# Altium schematic sheet POWER SWITCH AND LDO.SchDoc
size 420 x 297 mm; SheetNumber: 3; SheetTotal: 5
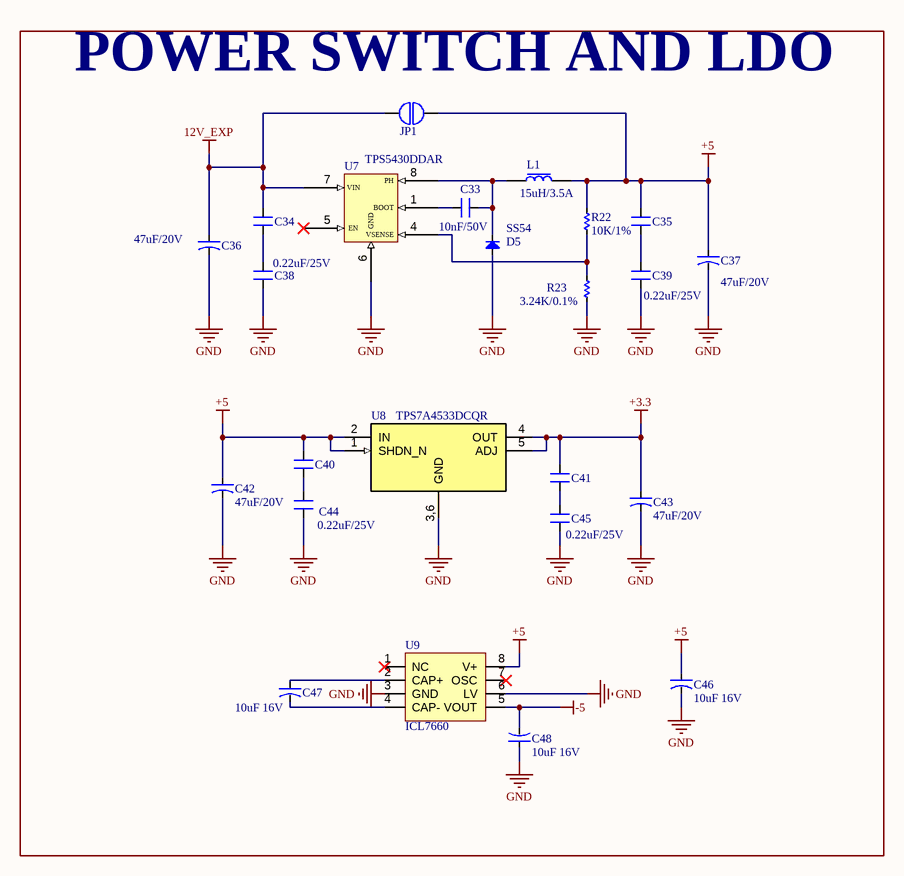
[diagram p0: POWER SWITCH AND LDO.SchDoc]

## Parts
C33  10nF/50V  [CN-SMD-0603]
C34  0.22uF/25V  [CN-SMD-0603]  (value not drawn)
C35  0.22uF/25V  [CN-SMD-0603]  (value not drawn)
C36  47uF/20V  [CAP TANT 2312]
C37  47uF/20V  [CAP TANT 2312]
C38  0.22uF/25V  [CN-SMD-0603]
C39  0.22uF/25V  [CN-SMD-0603]
C40  0.22uF/25V  [CN-SMD-0603]
C41  0.22uF/25V  [CN-SMD-0603]  (value not drawn)
C42  47uF/20V  [CAP TANT 2312]
C43  47uF/20V  [CAP TANT 2312]
C44  0.22uF/25V  [CN-SMD-0603]  (value not drawn)
C45  0.22uF/25V  [CN-SMD-0603]
C46  10uF 16V  [CAP_TANT_1206]
C47  10uF 16V  [CAP_TANT_1206]
C48  10uF 16V  [CAP_TANT_1206]
D5  SS54  [DIO-SMD-A]
JP1  JUMP2  [Jump2]  (value not drawn)
L1  15uH/3.5A  [SRP7050TA]
R22  10K/1%  [RES-SMD-0603]
R23  3.24K/0.1%  [RES-SMD-0603]
U7  TPS5430DDAR  [HSOP8]
U8  TPS7A4533DCQR  [SOT223-6]
U9  ICL7660  [SO8]

## Blocks framed on the sheet
POWER SWITCH AND LDO: C33-C48 D5 JP1 L1 R22 R23 U7-U9

## Nets
12V_EXP: C34.2 C36.1 JP1.1 U7.7(VIN)
+3.3: C41.2 C43.1 U8.4(OUT) U8.5(ADJ)
+5: C35.2 C37.1 C40.2 C42.1 C46.1 JP1.2 L1.2 R22.2 U8.1(SHDN_N) U8.2(IN) U9.8(V+)
-5: C48.2 U9.5(VOUT)
GND: C36.2 C37.2 C38.1 C39.1 C42.2 C43.2 C44.1 C45.1 C46.2 C48.1 D5.1(A) R23.1 U7.6(GND) U8.3,6(GND) U9.3(GND) U9.6(LV)
NetC33_1: C33.1 D5.2(K) L1.1 U7.8(PH)
NetC33_2: C33.2 U7.1(BOOT)
NetC34_1: C34.1 C38.2
NetC35_1: C35.1 C39.2
NetC40_1: C40.1 C44.2
NetC41_1: C41.1 C45.2
NetC47_1: C47.1 U9.2(CAP+)
NetC47_2: C47.2 U9.4(CAP-)
NetR22_1: R22.1 R23.2 U7.4(VSENSE)

Not connected (* = marked no-connect by the designer): U7 5(EN)*; U9 1(NC)* 7(OSC)*

## Notes on the sheet
- Project:
- BEE-PC1
- Sub-system:
- Design by:
- Hung Nguyen D.
- Bao Bui Q.
- Sheet title:
- Sheet
- A3
- of
- Checked by:
- Approved by:
- Vu Pham
- Revision:
- Document No:
- V1.2.1
- Size:
- Date:

## Library data of the parts
C33 = CM: CL10B103KB8NNNC; Value: 103
C34 C35 C38-C41 C44 C45 = CM: CL10B224KA8NNNC; Value: 103
C36 C37 C42 C43 = CN-ALU-SMD: TAJC476K020RNJ; Published: 8-Jun-2000; LatestRevisionDate: 17-Jul-2002; LatestRevisionNote: Re-released for DXP Platform.; PackageReference: POLAR0.8; Publisher: Altium Limited
C46-C48 = CN-ALU-SMD: TAJA106K016RNJ; Published: 8-Jun-2000; LatestRevisionDate: 17-Jul-2002; LatestRevisionNote: Re-released for DXP Platform.; PackageReference: POLAR0.8; Publisher: Altium Limited
D5 = Diode SMD: Code - JEDEC: DO-214-AB; Value: 1N5007; Published: 8-Jun-2000; Revision: July-2002: Re-released for DXP Platform.; Publisher: Altium Limited
L1 = INDUCTOR: SRP7050TA-150M
R22 = Res-SMD: ERJ-3EKF1002V; Manufacturer: Generic Components; Class: Passive; Published: 08/06/2000; Publisher: Altium Hobart Technology Centre
R23 = Res-SMD: ERA-3AEB3241V; Manufacturer: Generic Components; Class: Passive; Published: 08/06/2000; Publisher: Altium Hobart Technology Centre
U7 = TPS543X: pin to pad: 6>6+9
U9 = ICL7660: ICL7660ACBAZA-T; Creator: Nguyen Ba Bien